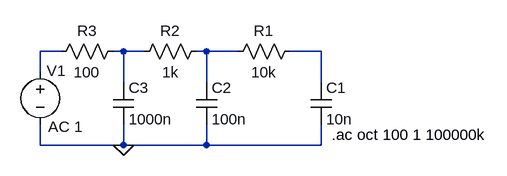
[diagram p0: schematic 3rdOrderLPF.asc]
3rdOrderLPF.asc, the LTspice schematic file:
Version 4
SHEET 1 880 680
WIRE -192 64 -224 64
WIRE -96 64 -112 64
WIRE -64 64 -96 64
WIRE 32 64 16 64
WIRE 80 64 32 64
WIRE 208 64 160 64
WIRE -224 96 -224 64
WIRE -96 112 -96 64
WIRE 32 112 32 64
WIRE 208 112 208 64
WIRE -224 208 -224 176
WIRE -96 208 -96 176
WIRE -96 208 -224 208
WIRE 32 208 32 176
WIRE 32 208 -96 208
WIRE 208 208 208 176
WIRE 208 208 32 208
FLAG -96 208 0
SYMBOL cap 192 112 R0
SYMATTR InstName C1
SYMATTR Value 10n
SYMBOL res 176 48 R90
WINDOW 0 0 56 VBottom 2
WINDOW 3 32 56 VTop 2
SYMATTR InstName R1
SYMATTR Value 10k
SYMBOL cap 16 112 R0
SYMATTR InstName C2
SYMATTR Value 100n
SYMBOL res 32 48 R90
WINDOW 0 0 56 VBottom 2
WINDOW 3 32 56 VTop 2
SYMATTR InstName R2
SYMATTR Value 1k
SYMBOL voltage -224 80 R0
WINDOW 0 10 14 Left 2
WINDOW 123 12 100 Left 2
WINDOW 39 0 0 Left 0
SYMATTR InstName V1
SYMATTR Value ""
SYMATTR Value2 AC 1
SYMBOL cap -112 112 R0
SYMATTR InstName C3
SYMATTR Value 1000n
SYMBOL res -96 48 R90
WINDOW 0 0 56 VBottom 2
WINDOW 3 32 56 VTop 2
SYMATTR InstName R3
SYMATTR Value 100
TEXT 224 192 Left 2 !.ac oct 100 1 100000k

The netlist it stands for:
* 3rdOrderLPF.asc
C1 N004 0 10n
R1 N004 N003 10k
C2 N003 0 100n
R2 N003 N002 1k
V1 N001 0 AC 1
C3 N002 0 1000n
R3 N002 N001 100
.ac oct 100 1 100000k
.backanno
.end